# EasyEDA Pro project ProPrj_WatcheRobot2.0openSource_2026-06-17.epro, schematic Schematic2
Assembly Variant: Basic; Board Name: Board1; Create Date: 2026-04-26; Page Name: P1; Project Name: WatcheRobot2.0; Schematic Name: Schematic2; Update Date: 2026-04-26; Company: 嘉立创EDA; Page Size: A4; Version: V1.0
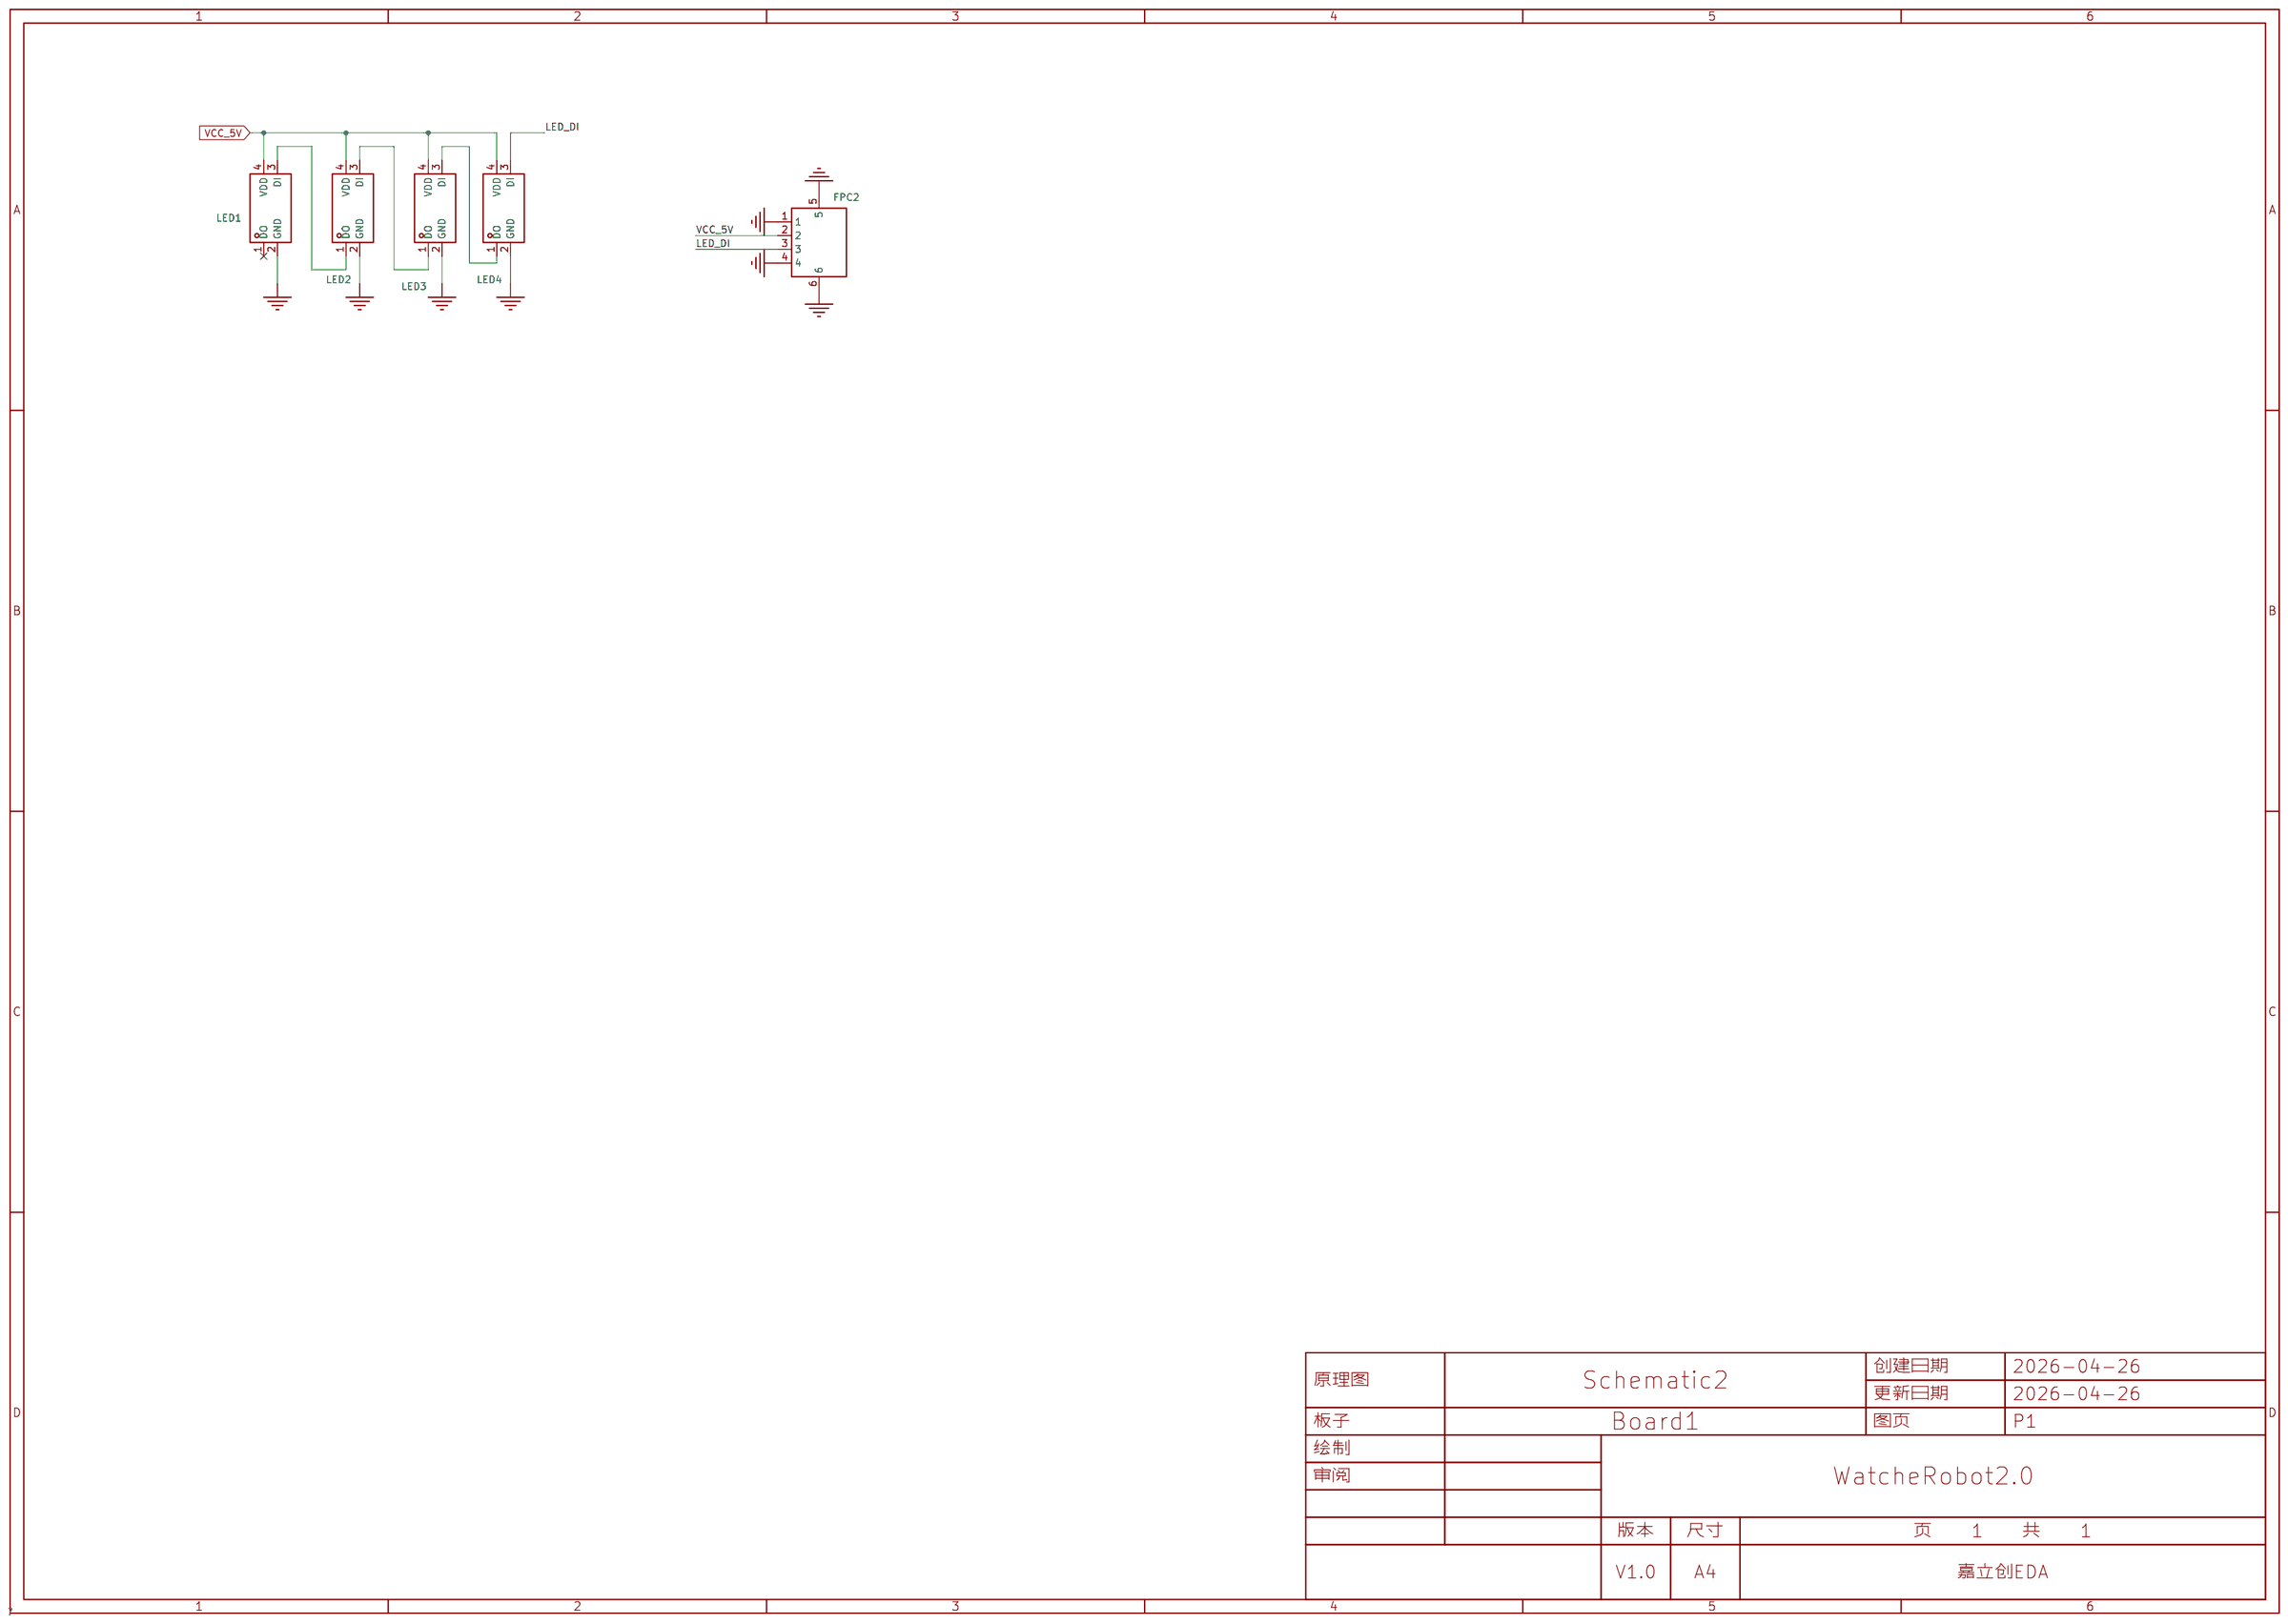
[diagram p2: schematic sheet]

## Parts
FPC2  FPC4_1mm(下接)  [FPC-SMD_4P-P1.00_C9900022405]
LED1  WS2812B-2020  [LED-SMD_4P-L2.0-W2.0-TL_WS2812B-2020]
LED2  WS2812B-2020  [LED-SMD_4P-L2.0-W2.0-TL_WS2812B-2020]
LED3  WS2812B-2020  [LED-SMD_4P-L2.0-W2.0-TL_WS2812B-2020]
LED4  WS2812B-2020  [LED-SMD_4P-L2.0-W2.0-TL_WS2812B-2020]

## Library data of the parts
FPC2 = FPC4_1mm(下接): Supplier Part: C9900022405; Supplier Footprint: FPC-SMD_4P-P1.00; JLCPCB Part Class: Extended Part; Supplier: LCSC
LED1-LED4 = WS2812B-2020: 12mA，小尺寸，高亮，用于小间距，小尺寸产品（注意防潮，请查阅规格书中对应具体内容）; LCSC Part Name: RGB三色; Supplier Part: C965555; Manufacturer: worldsemi; Supplier Footprint: SMD,2.2x2mm; JLCPCB Part Class: 扩展库; Datasheet: https://item.szlcsc.com/datasheet/WS2812B-2020/1051115.html; Supplier: LCSC; Wavelength: 515.6nm；622.5nm；470.4nm; Luminous Intensity: 200mcd；160mcd；520mcd; Data Transmission Rate: 100KB/S; Voltage - Supply: 5V; Installation method: 正贴

## Nets
GND: FPC2.1 FPC2.4 FPC2.5 FPC2.6 LED1.2(GND) LED2.2(GND) LED3.2(GND) LED4.2(GND)
VCC_5V: FPC2.2 LED1.4(VDD) LED2.4(VDD) LED3.4(VDD) LED4.4(VDD)
LED_DI: FPC2.3 LED4.3(DI)
$1N15: LED3.3(DI) LED4.1(DO)
$1N16: LED2.3(DI) LED3.1(DO)
$1N22: LED1.3(DI) LED2.1(DO)

Not connected (* = marked no-connect by the designer): LED1 1(DO)*
